# EAGLE design TechWomen (EAGLE 7.7.0)
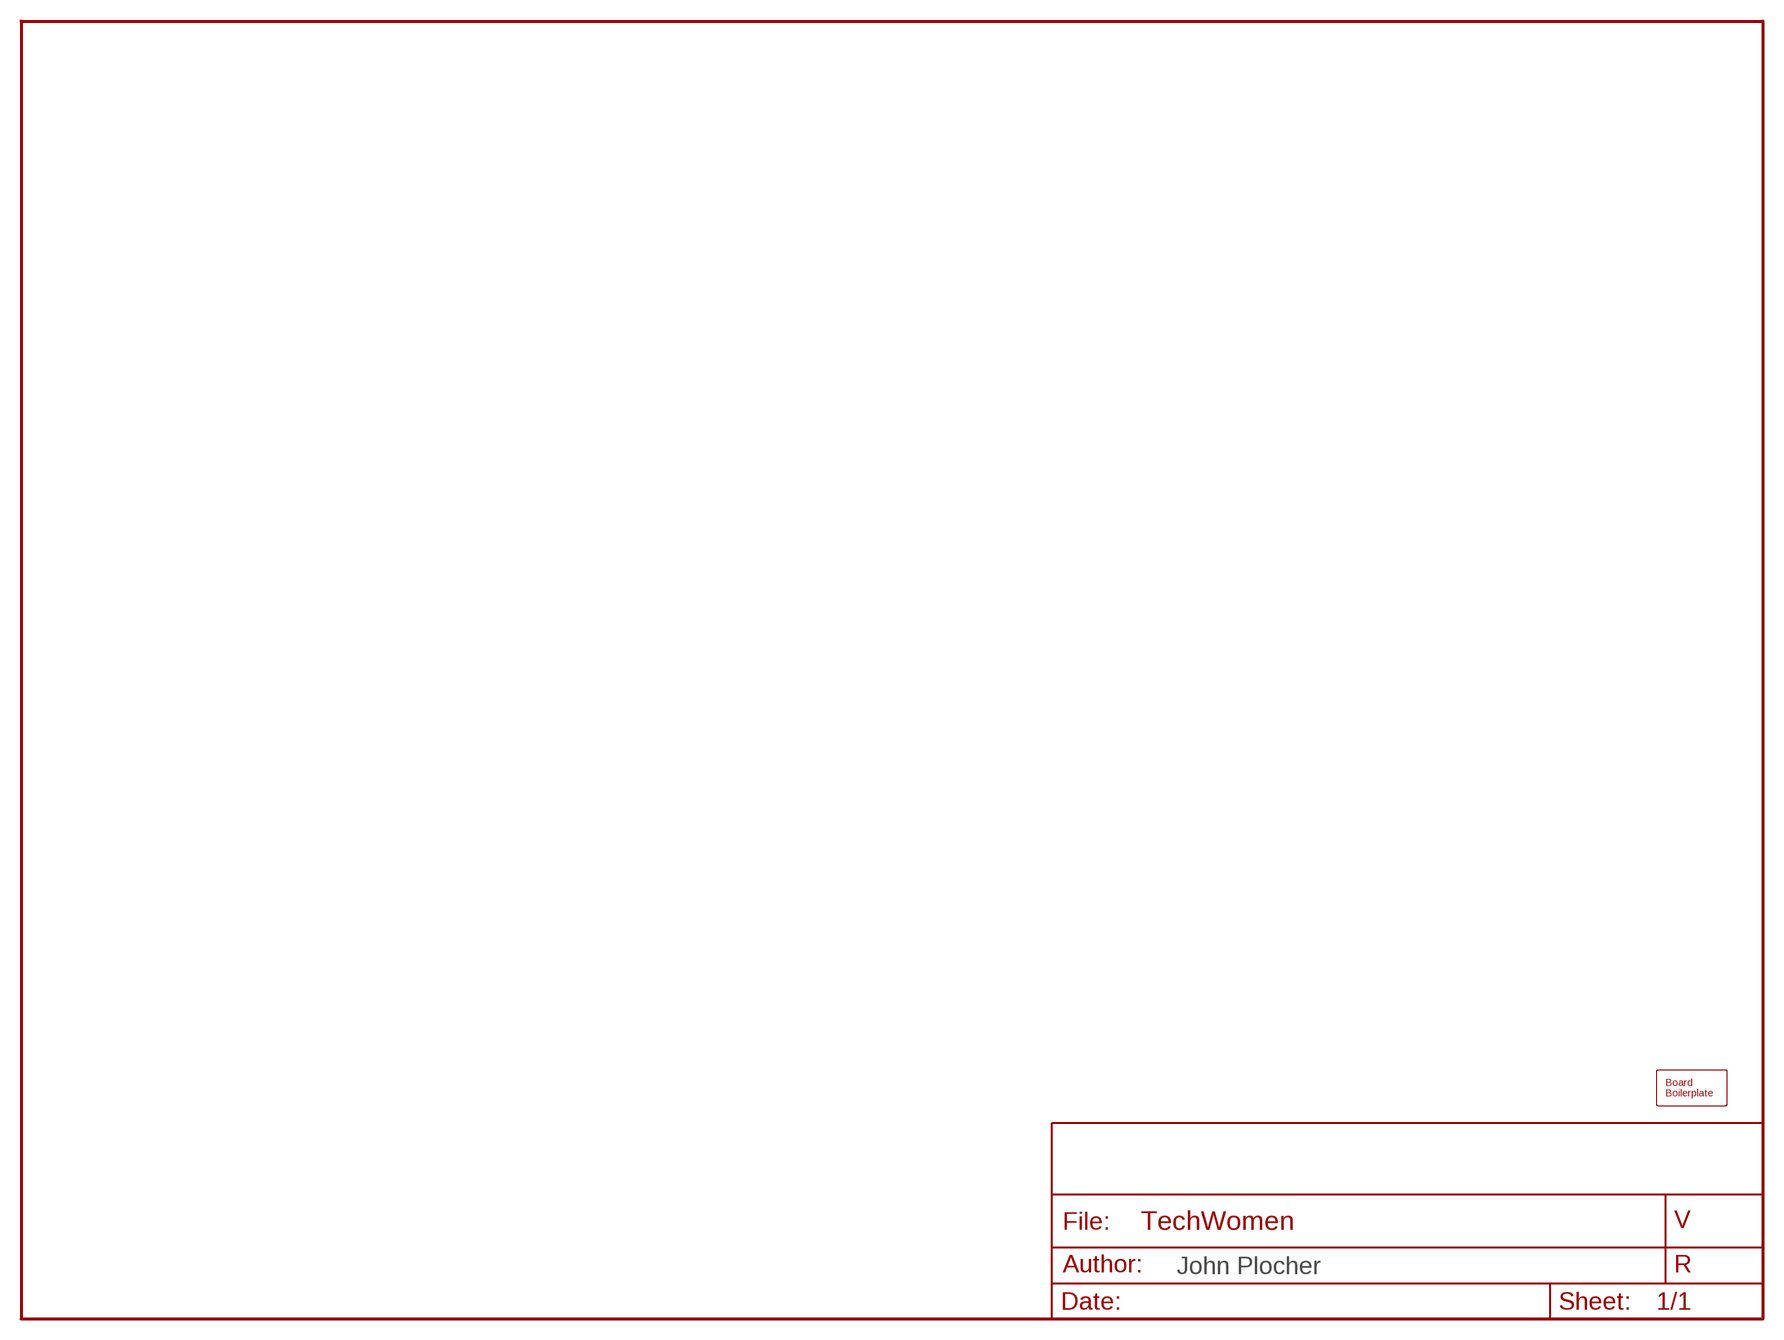
[diagram p0: schematic, sheet 1]

## Parts
BOARD1  BOARD10X5/2  [BOARD-10X10/2]

## Library data of the parts
BOARD1 = SPCoast:BOARD

## Board
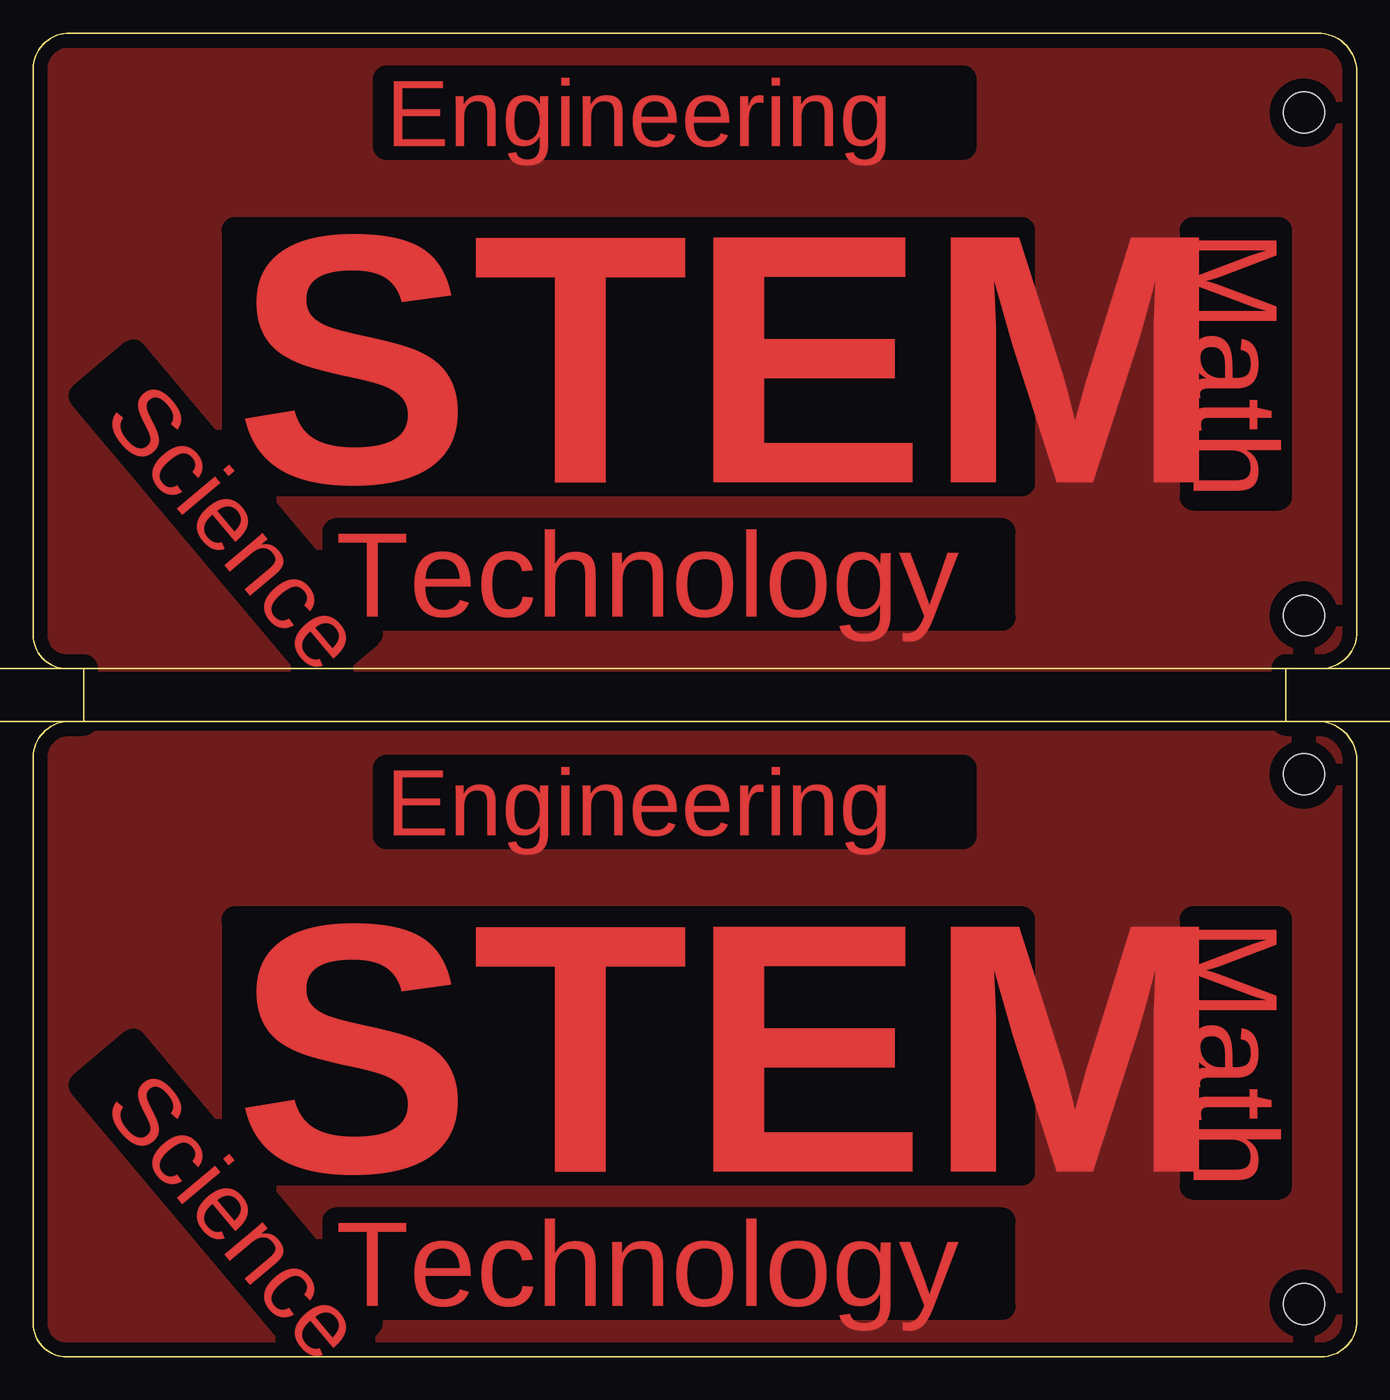
[diagram p1: board, top side]
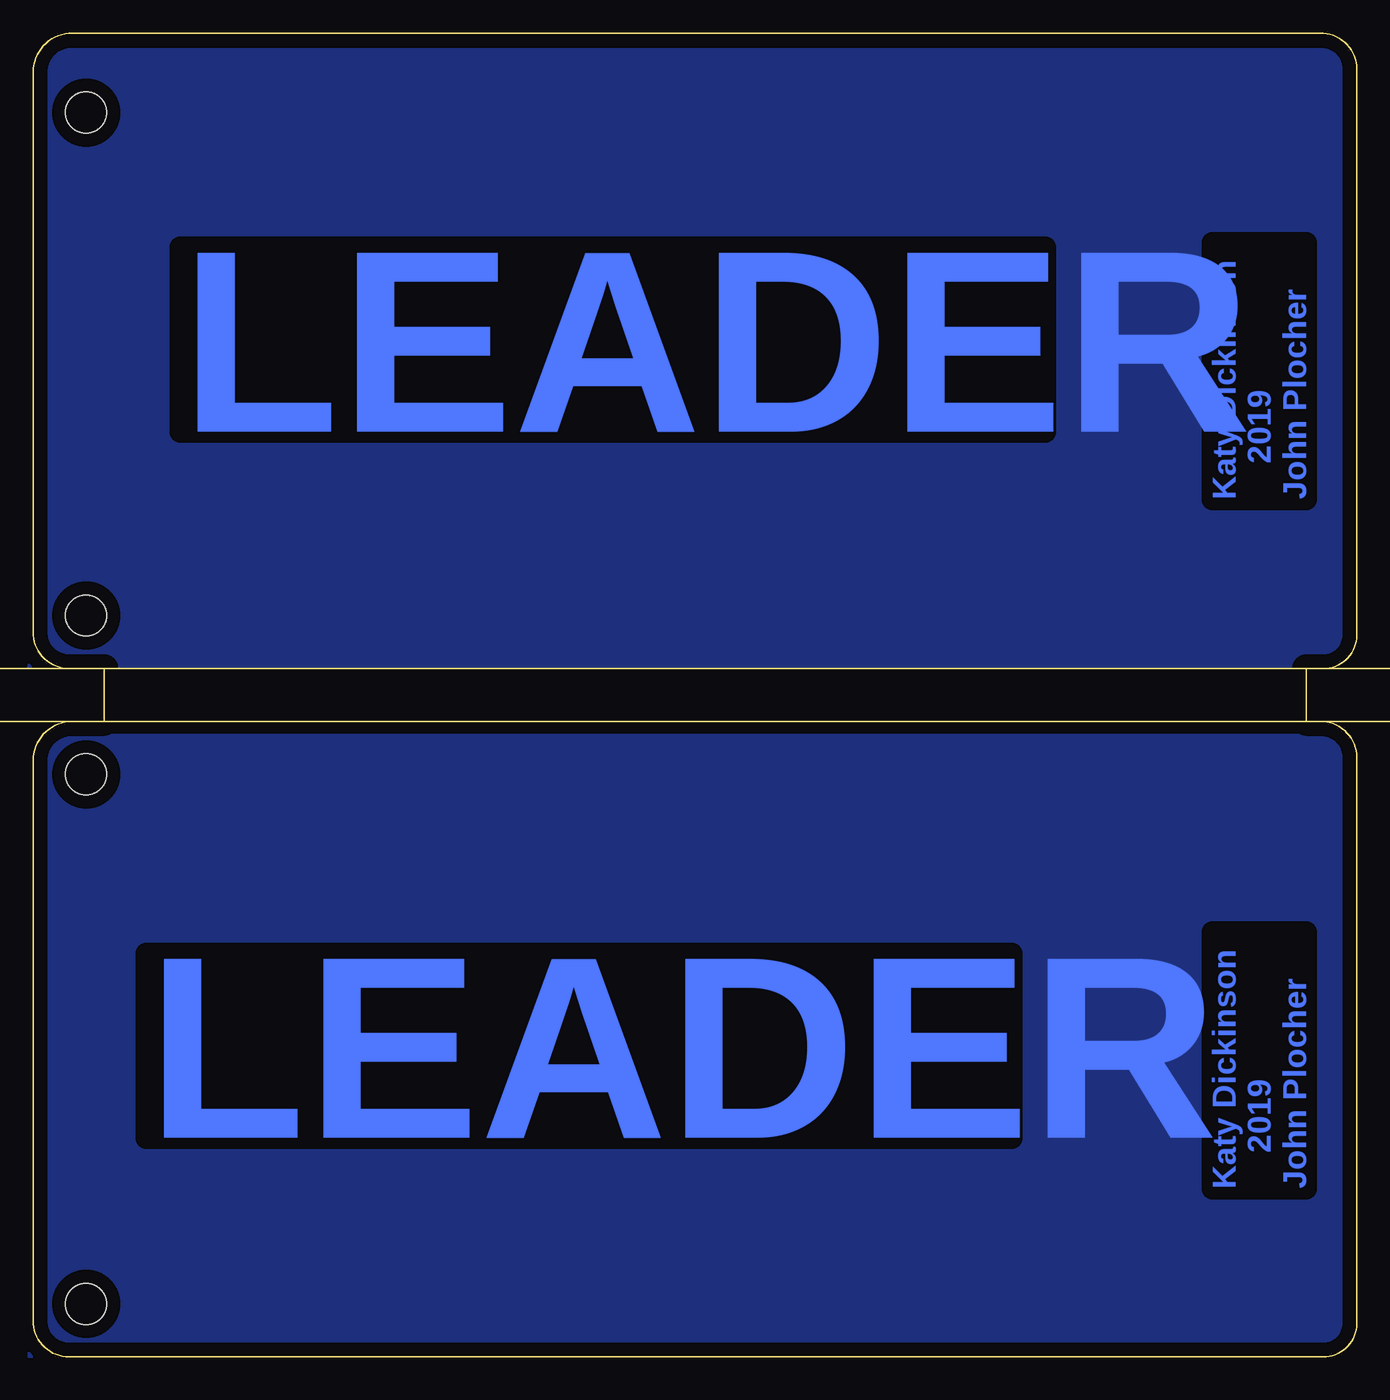
[diagram p2: board, bottom side, seen from below]

Size 100.01 x 100.01 mm. Coordinates in mm from the lower left corner, seen from the top.
Copper layers (1*16): Top 0.035mm / dielectric 1.5mm / Bottom 0.035mm
Design rules "default": minimum track width 10mil, minimum drill 0.6mm, track to track 8mil, track to pad 8mil, pad to pad 8mil, via to via 8mil, smd to smd 8mil, copper to edge 40mil, drill to drill 8mil, minimum pad ring 10mil, minimum via ring 8mil, stop-mask expansion 4mil, vias tented up to drill 0mil, thermal gap 10mil

### Footprints (pad centres in the part's own frame; a part is rotated, then mirrored left to right if it is on the bottom)
BOARD-10X10/2 = hole 3.1: 96,94; 96,56; 96,4; 96,44

### Placement (x,y rotation side)
BOARD1  0.01,0.01 0 top

### Tracks (layer width: path | path; a pad name or v marks a point on that pad's centre or on a via)
N$1
  pour Top (isolate 1.016): 0.01,47 0.01,0.01 100.34,0.01 100.34,47
N$2
  pour Bottom (isolate 0.813): 0.01,47 0.01,0.01 100.34,0.01 100.34,47
N$3
  pour Top (isolate 1.016): 0.01,99.07 0.01,52.08 100.34,52.08 100.34,99.07
N$4
  pour Bottom (isolate 0.813): 0.01,99.07 0.01,52.08 100.34,52.08 100.34,99.07

### Text on the board
Top: Engineering | Math | STEM | Technology | Science | Engineering | Math | STEM | Technology | Science
Bottom: LEADER | Katy Dickinson / 2019 / John Plocher | LEADER | Katy Dickinson / 2019 / John Plocher
tDocu: Technical | Woman | Technical | Woman
bDocu: "I was taught that the / way of progress was / neither swift nor easy." | - Marie Curie | "Yes, I'm a feminist, because / I see all women as / smart, gifted, and tough." | - Zaha Hadid